# Altium schematic sheet sha2017_rev1_0_0_1.SchDoc: sha2017_rev1_0_0
size 409 x 282 mm; Date: 4/24/2017 5:58:59 PM; SheetNumber: 2
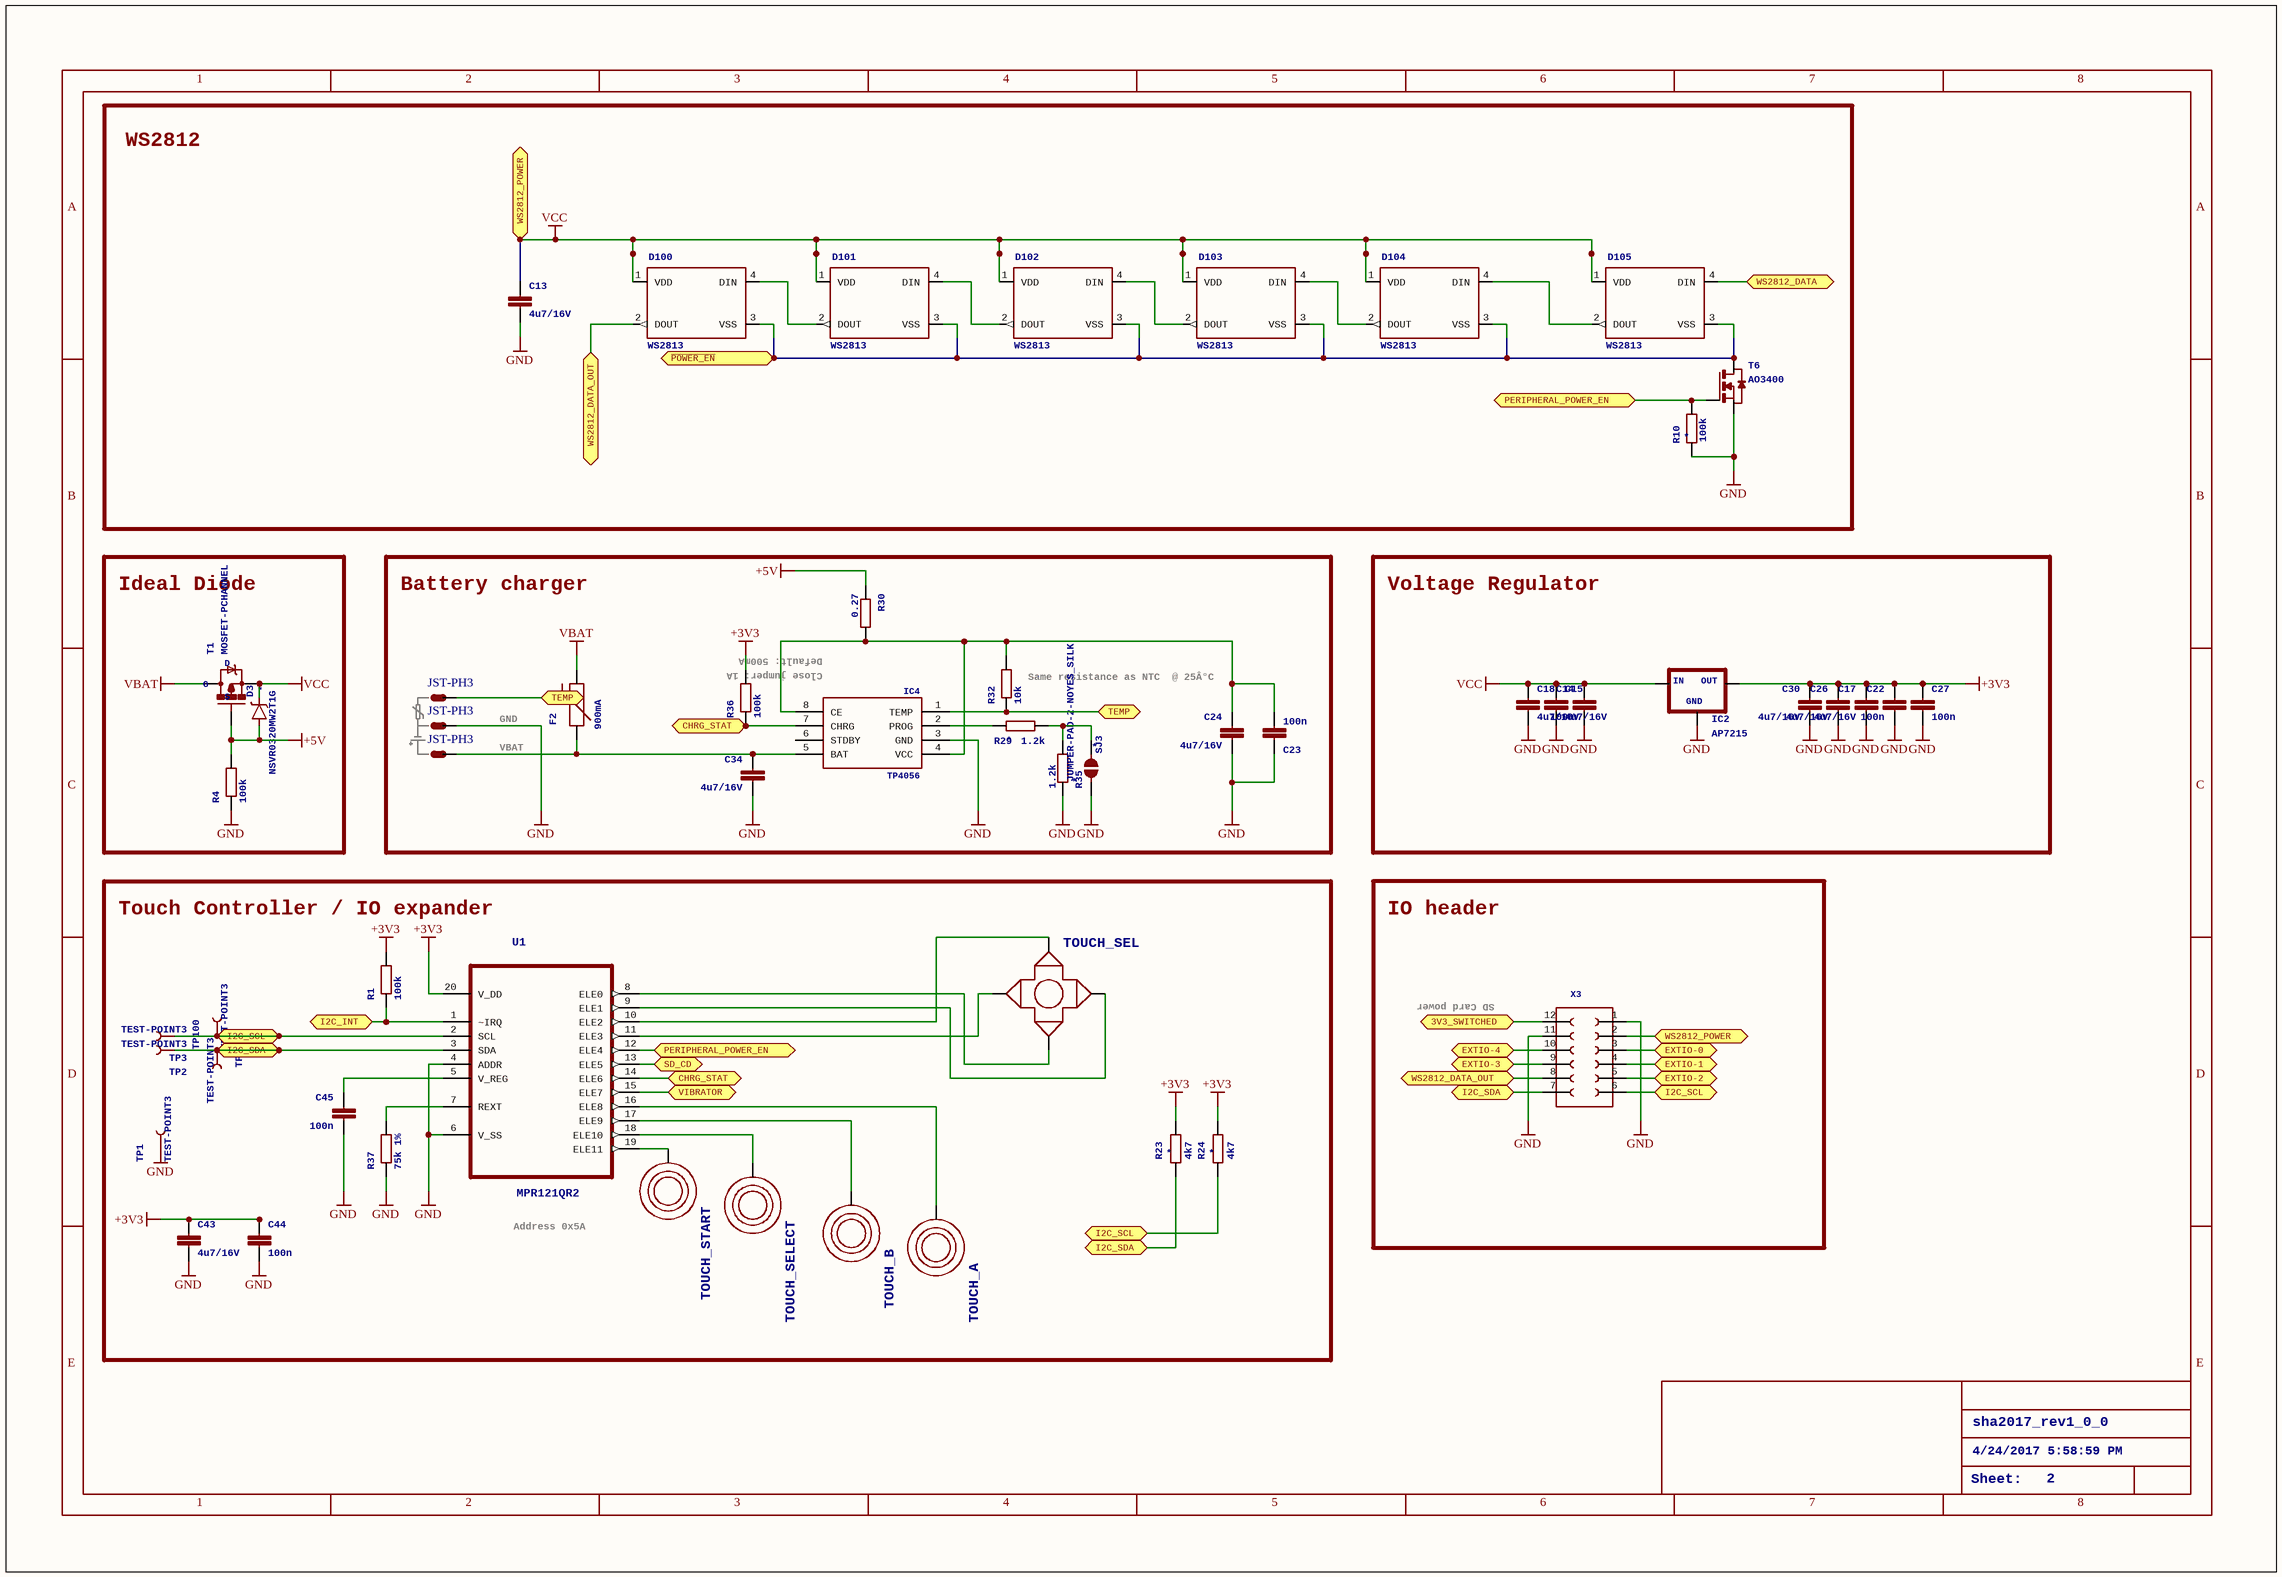
[diagram p0: sha2017_rev1_0_0_1.SchDoc]

## Parts
C13  4u7/16V  [C0805]
C14  100n  [C0603-DASHES]
C15  4u7/16V  [C0805]
C17  4u7/16V  [C0805]
C18  4u7/16V  [C0805]
C22  100n  [C0603-DASHES]
C23  100n  [C0603-DASHES]
C24  4u7/16V  [C0805]
C26  4u7/16V  [C0805]
C27  100n  [C0603-DASHES]
C30  4u7/16V  [C0805]
C34  4u7/16V  [C0805]
C43  4u7/16V  [C0805]
C44  100n  [C0603-DASHES]
C45  100n  [C0603-DASHES]
D3  NSVR0320MW2T1G  [SOD-323]
D100  WS2813  [WS2812B]
D101  WS2813  [WS2812B]
D102  WS2813  [WS2812B]
D103  WS2813  [WS2812B]
D104  WS2813  [WS2812B]
D105  WS2813  [WS2812B]
F2  900mA  [PTC-1206]
IC2  AP7215  [SOT89]
IC4  TP4056  [SOP-8]
R1  100k  [R0603-DASHES]
R4  100k  [R0603-DASHES]
R10  100k  [R0603-DASHES]
R23  4k7  [R0603-DASHES]
R24  4k7  [R0603-DASHES]
R29  1.2k  [R0603-DASHES]
R30  0.27  [R0603-DASHES]
R32  10k  [R0603-DASHES]
R35  1.2k  [R0603-DASHES]
R36  100k  [R0603-DASHES]
R37  75k 1%  [R0603-DASHES]
SJ3  JUMPER-PAD-2-NOYES_SILK  [PAD-JUMPER-2-NO_YES_SILK]
T1  MOSFET-PCHANNEL  [SOT23-3]
T6  AO3400  [SOT-23]
TOUCH_A  TOUCHROUND  [TOUCH_BUTTON]  (value not drawn)
TOUCH_B  TOUCHROUND  [TOUCH_BUTTON]  (value not drawn)
TOUCH_SEL  TOUCH_CROSS  [TOUCH_CROSS]  (value not drawn)
TOUCH_SELECT  TOUCHSELECT  [TOUCH_SELECT]  (value not drawn)
TOUCH_START  TOUCHSELECT  [TOUCH_SELECT]  (value not drawn)
TP1  TEST-POINT3  [PAD.03X.03]
TP2  TEST-POINT3  [PAD.03X.03]
TP3  TEST-POINT3  [PAD.03X.03]
TP100  TEST-POINT3  [PAD.03X.03]
TP101  TEST-POINT3  [PAD.03X.03]
U1  MPR121QR2  [QFN40P300X300X60-20N]
X3  610X12243021  [610X12243021]  (value not drawn)
X4  JST-PH3  [JST-PH3]  (parts A,B,C of 3)

## Blocks framed on the sheet
WS2812: C13 D100-D105 R10 T6
Ideal Diode: D3 R4 T1
Battery charger: C23 C24 C34 F2 IC4 R29 R30 R32 R35 R36 SJ3 X4
Voltage Regulator: C14 C15 C17 C18 C22 C26 C27 C30 IC2
Touch Controller / IO expander: C43-C45 R1 R23 R24 R37 TOUCH_A TOUCH_B TOUCH_SEL TOUCH_SELECT TOUCH_START TP1-TP3 TP100 TP101 U1
IO header: X3

## Ports
3V3_SWITCHED, CHRG_STAT, EXTIO-0, EXTIO-1, EXTIO-2, EXTIO-3, EXTIO-4, I2C_INT, I2C_SCL, I2C_SDA, PERIPHERAL_POWER_EN, SD_CD, TEMP, VIBRATOR, WS2812_DATA, WS2812_DATA_OUT, WS2812_POWER, ~{POWER_EN}

## Nets
+3V3: C17.1 C22.1 C26.1 C27.1 C30.1 C43.1 C44.1 IC2.3(OUT) R1.2 R23.1 R24.1 R36.2 U1.20(V_DD)
+5V: D3.A R4.2 R30.1 T1.1(G)
GND: C13.2 C14.2 C15.2 C17.2 C18.2 C22.2 C23.1 C24.2 C26.2 C27.2 C30.2 C34.2 C43.2 C44.2 C45.2 IC2.1(GND) IC4.3(GND) R4.1 R10.2 R35.2 R37.1 SJ3.1 T6.2(S) TP1.P$1 U1.4(ADDR) U1.6(V_SS) X3.1 X3.11 X4.2
VBAT: F2.2 T1.3(D)
VCC: C13.1 C14.1 C15.1 C18.1 D3.C D100.1(VDD) D101.1(VDD) D102.1(VDD) D103.1(VDD) D104.1(VDD) D105.1(VDD) IC2.2_2@(IN) T1.2(S) X3.2 ; port WS2812_POWER
3V3_SWITCHED: X3.12 ; port 3V3_SWITCHED
~{POWER_EN}: D100.3(VSS) D101.3(VSS) D102.3(VSS) D103.3(VSS) D104.3(VSS) D105.3(VSS) T6.1(D) ; port ~{POWER_EN}
CHRG_STAT: IC4.7(CHRG) R36.1 U1.14(ELE6) ; port CHRG_STAT
EXTIO-0: X3.3 ; port EXTIO-0
EXTIO-1: X3.4 ; port EXTIO-1
EXTIO-2: X3.5 ; port EXTIO-2
EXTIO-3: X3.9 ; port EXTIO-3
EXTIO-4: X3.10 ; port EXTIO-4
I2C_INT: R1.1 U1.1(~IRQ) ; port I2C_INT
I2C_SCL: R24.2 TP3.P$1 TP100.P$1 U1.2(SCL) X3.6 ; port I2C_SCL
I2C_SDA: R23.2 TP2.P$1 TP101.P$1 U1.3(SDA) X3.7 ; port I2C_SDA
PERIPHERAL_POWER_EN: R10.1 T6.3(G) U1.12(ELE4) ; port PERIPHERAL_POWER_EN
SD_CD: U1.13(ELE5) ; port SD_CD
TEMP: IC4.1(TEMP) R32.1 X4.1 ; port TEMP
VIBRATOR: U1.15(ELE7) ; port VIBRATOR
WS2812_DATA: D105.4(DIN) ; port WS2812_DATA
WS2812_DATA_OUT: D100.2(DOUT) X3.8 ; port WS2812_DATA_OUT
NetC23_2: C23.2 C24.1 IC4.4(VCC) IC4.8(CE) R30.2 R32.2
NetC34_1: C34.1 F2.1 IC4.5(BAT) X4.3
NetC45_1: C45.1 U1.5(V_REG)
NetD100_4: D100.4(DIN) D101.2(DOUT)
NetD101_4: D101.4(DIN) D102.2(DOUT)
NetD102_4: D102.4(DIN) D103.2(DOUT)
NetD103_4: D103.4(DIN) D104.2(DOUT)
NetD104_4: D104.4(DIN) D105.2(DOUT)
NetIC4_2: IC4.2(PROG) R29.1
NetR29_2: R29.2 R35.1 SJ3.2
NetR37_2: R37.2 U1.7(REXT)
NetTOUCH_A_P$1: TOUCH_A.P$1 U1.16(ELE8)
NetTOUCH_B_P$1: TOUCH_B.P$1 U1.17(ELE9)
NetTOUCH_SEL_D: TOUCH_SEL.D(DOWN) U1.8(ELE0)
NetTOUCH_SEL_L: TOUCH_SEL.L(LEFT) U1.11(ELE3)
NetTOUCH_SEL_R: TOUCH_SEL.R(RIGHT) U1.9(ELE1)
NetTOUCH_SEL_UP: TOUCH_SEL.UP U1.10(ELE2)
NetTOUCH_SELECT_P$1: TOUCH_SELECT.P$1 U1.18(ELE10)
NetTOUCH_START_P$1: TOUCH_START.P$1 U1.19(ELE11)

Not connected (* = marked no-connect by the designer): IC4 6(STDBY)

## Notes on the sheet
- Default: 500mA
- Close jumper: 1A
- (near R32) Same resistance as NTC
  @ 25Â°C
- GND
- VBAT
- SD Card power
- Address 0x5A
- sha2017_rev1_0_0
- 4/24/2017 5:58:59 PM
- Sheet:
- 2
- 1
- 3
- 4
- 5
- 6
- 7
- 8
- A
- B
- C
- D
- E

## Library data of the parts
C13 C15 C17 C18 C24 C26 C30 C34 C43 = C-EUC0805: CAPACITOR, European symbol; PARTNO: *
C14 C22 C23 C27 C44 C45 = C0603-DASHES: PARTNO: *
D3 = BAT20JFILM: 23V, 1A Schottky diode, SOD-323 package; PROD_ID: DIO-11623; NAME: *; PARTNO: *
D100-D105 = WS2812B: WS2812B - Intelligent control LED integrated light source    Technical Specifications:  Power Supply Voltage (VDD): 3.5 to 5.3 V  Input Voltage (VI): -0.5 to VDD+0.5 V  Operating Junction Temperature (Topt): -25Â°C to +80Â°C  Storage Temperature Range (Tstg): -55Â°C to +150Â°C; PARTNO: *
F2 = PTCSMD: Resettable Fuse PTCResettable Fuse. Spark Fun Electronics SKU : COM-08357; PROD_ID: RES-11150; PARTNO: *
R1 R4 R10 R23 R24 R29 R30 R32 R35-R37 = R0603-DASHES: PARTNO: *
  R10 R29 R35: NAME: *
  R23 R24: MF: *; MPN: *; NAME: *; OC_FARNELL: *
T1 = MOSFET-PCHANNEL: Generic PMOSFET    IRLML2244 - TRANS-11153 (SOT-23 -20V -4.3A) (1.Gate 2.Source 3.Drain)     FQP27P06 - COM-10349(TO-220 -60V -27A) (1.Gate 2.Source 3.Drain); PROD_ID: TRANS-08285; PARTNO: *; D: D; S: S; G: G
T6 = NMOSSOT23: MOS FET; MF: *; MPN: *; OC_FARNELL: unknown; OC_NEWARK: unknown
TP1-TP3 TP100 TP101 = TEST-POINT3: Bare copper test points for troubleshooting or ICT; PARTNO: *
U1 = MPR121QR2: Proximity Capacitive Touch Sensor Controller; MPN: MPR121QR2; OC_FARNELL: 1858714; OC_NEWARK: 24R9786; PACKAGE: QFN-20; SUPPLIER: Freescale
X3 = 610X12243021: WR-PHD 2.54mm SMT Dual Socket Header Bottom Entry, 12 Pins=>Code : Con_BTB_SHD_2.54_2_610x12243021(packageing:x = 0: Tube x = 3: Tape & Reel with Cap)     Details see: 6100xx243021 http://katalog.we-online.de/en/em/PHD_2_54_SMT_DUAL_SOCKET_HEADER_BOTTOM_ENTRY_6100XX243021   6103xx243021 http://katalog.we-online.de/en/em/PHD_2_54_SMT_DUAL_SOCKET_HEADER_BOTTOM_ENTRY_6103XX243021   2014 (C) WÃ¼rth Elektronik; PARTNO: *
IC2 = AP7215: PARTNO: *; GND: GND; IN: IN; OUT: OUT
SJ3 = JUMPER-PAD-2-NOYES_SILK: NAME: *; PARTNO: *
TOUCH_A TOUCH_B = TOUCHROUND: PARTNO: *
TOUCH_SEL = TOUCH_CROSS: PARTNO: *